# Altium schematic sheet UI.SchDoc
size A4; SheetNumber: 6; SheetTotal: 14
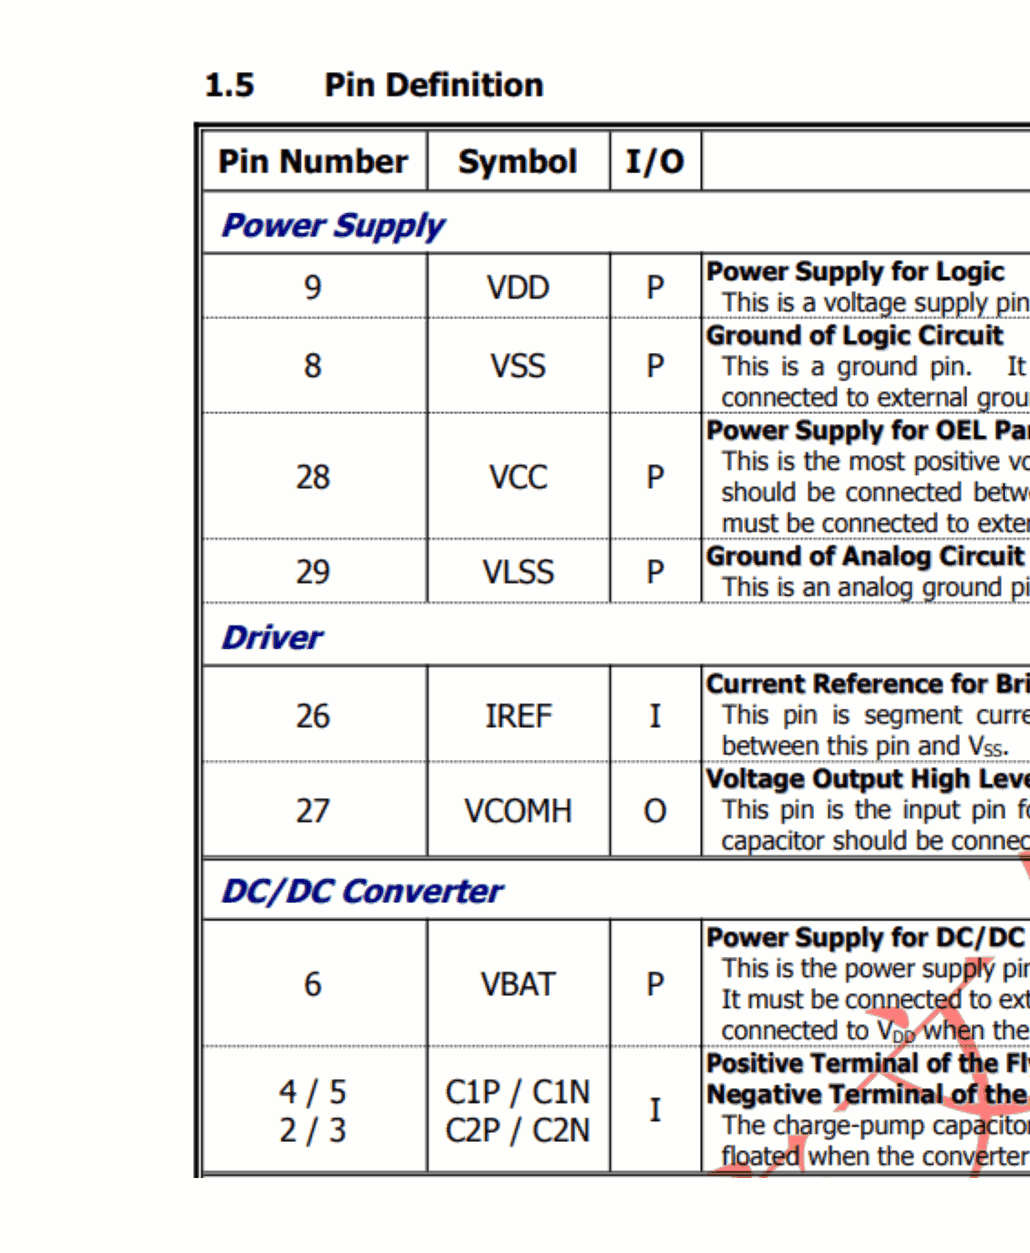
[diagram p0: UI.SchDoc, top left]
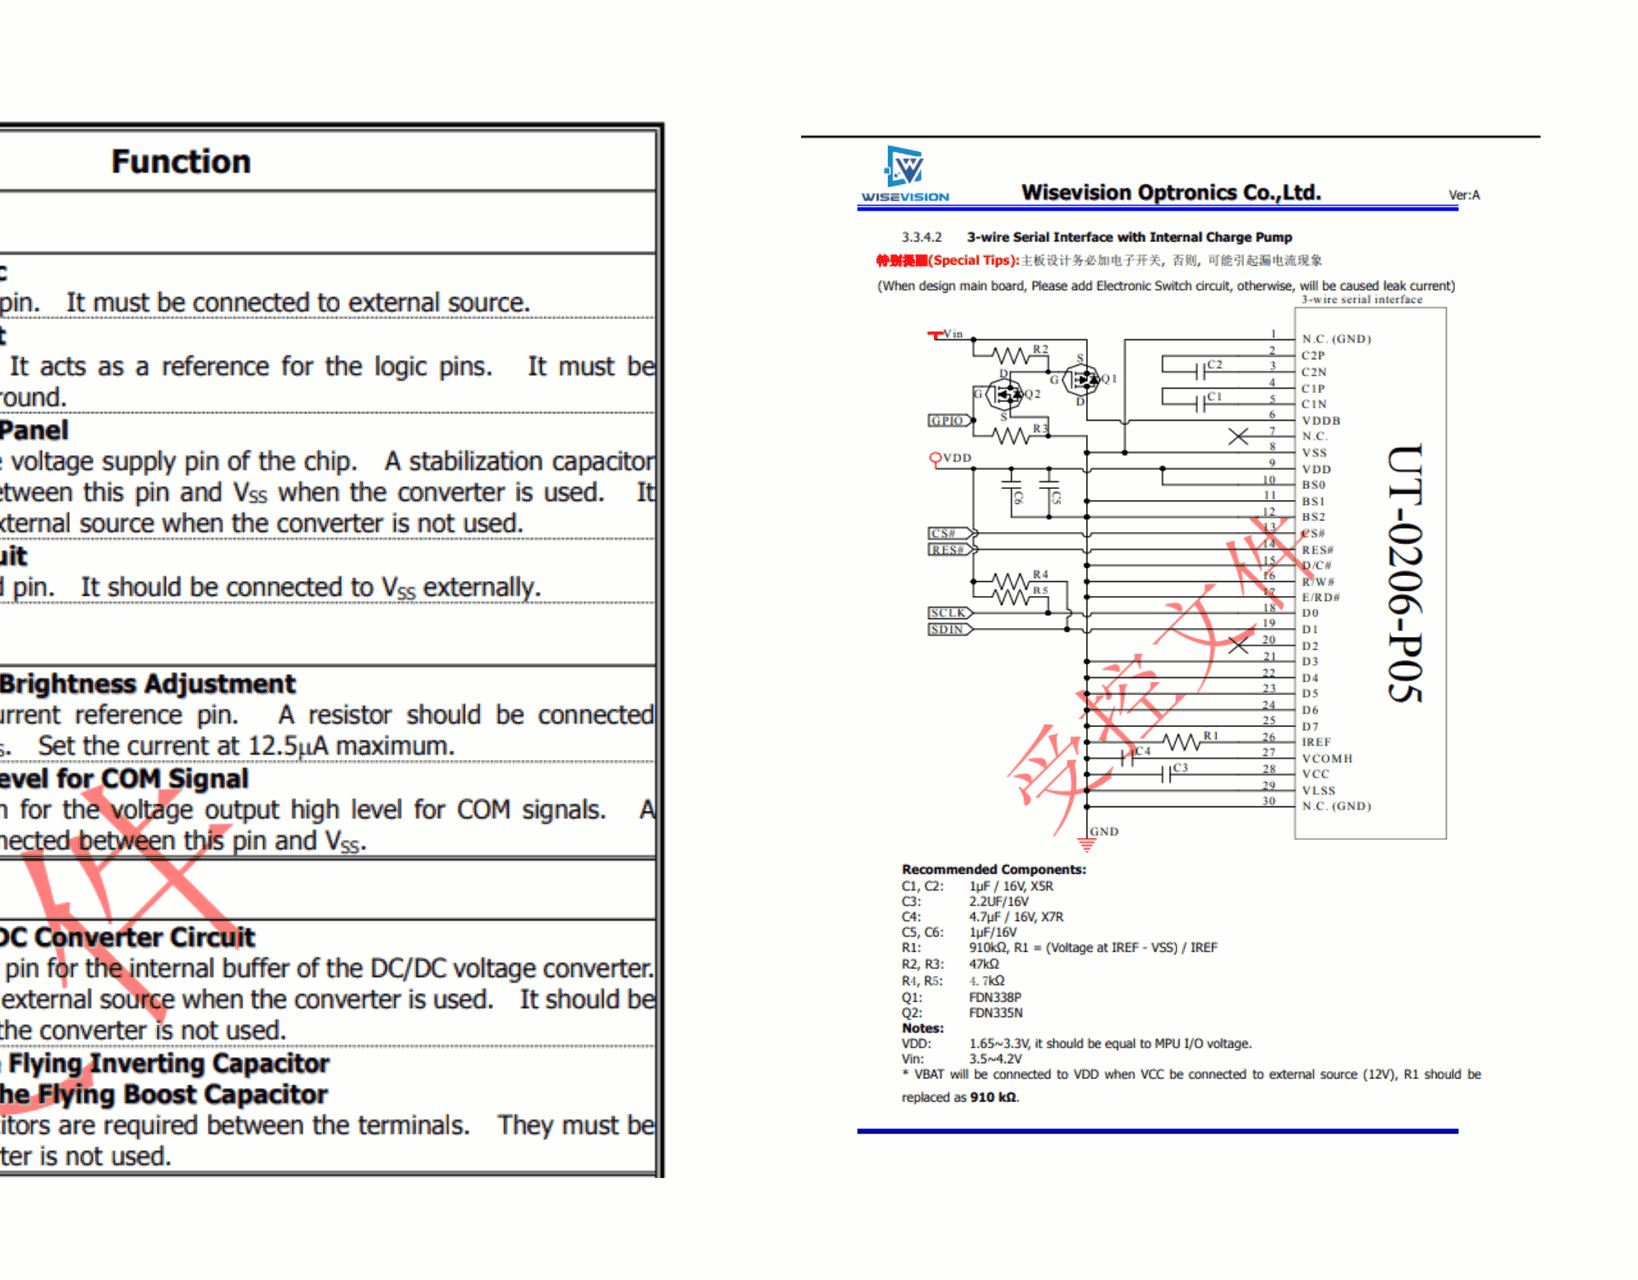
[diagram p1: UI.SchDoc, top right]
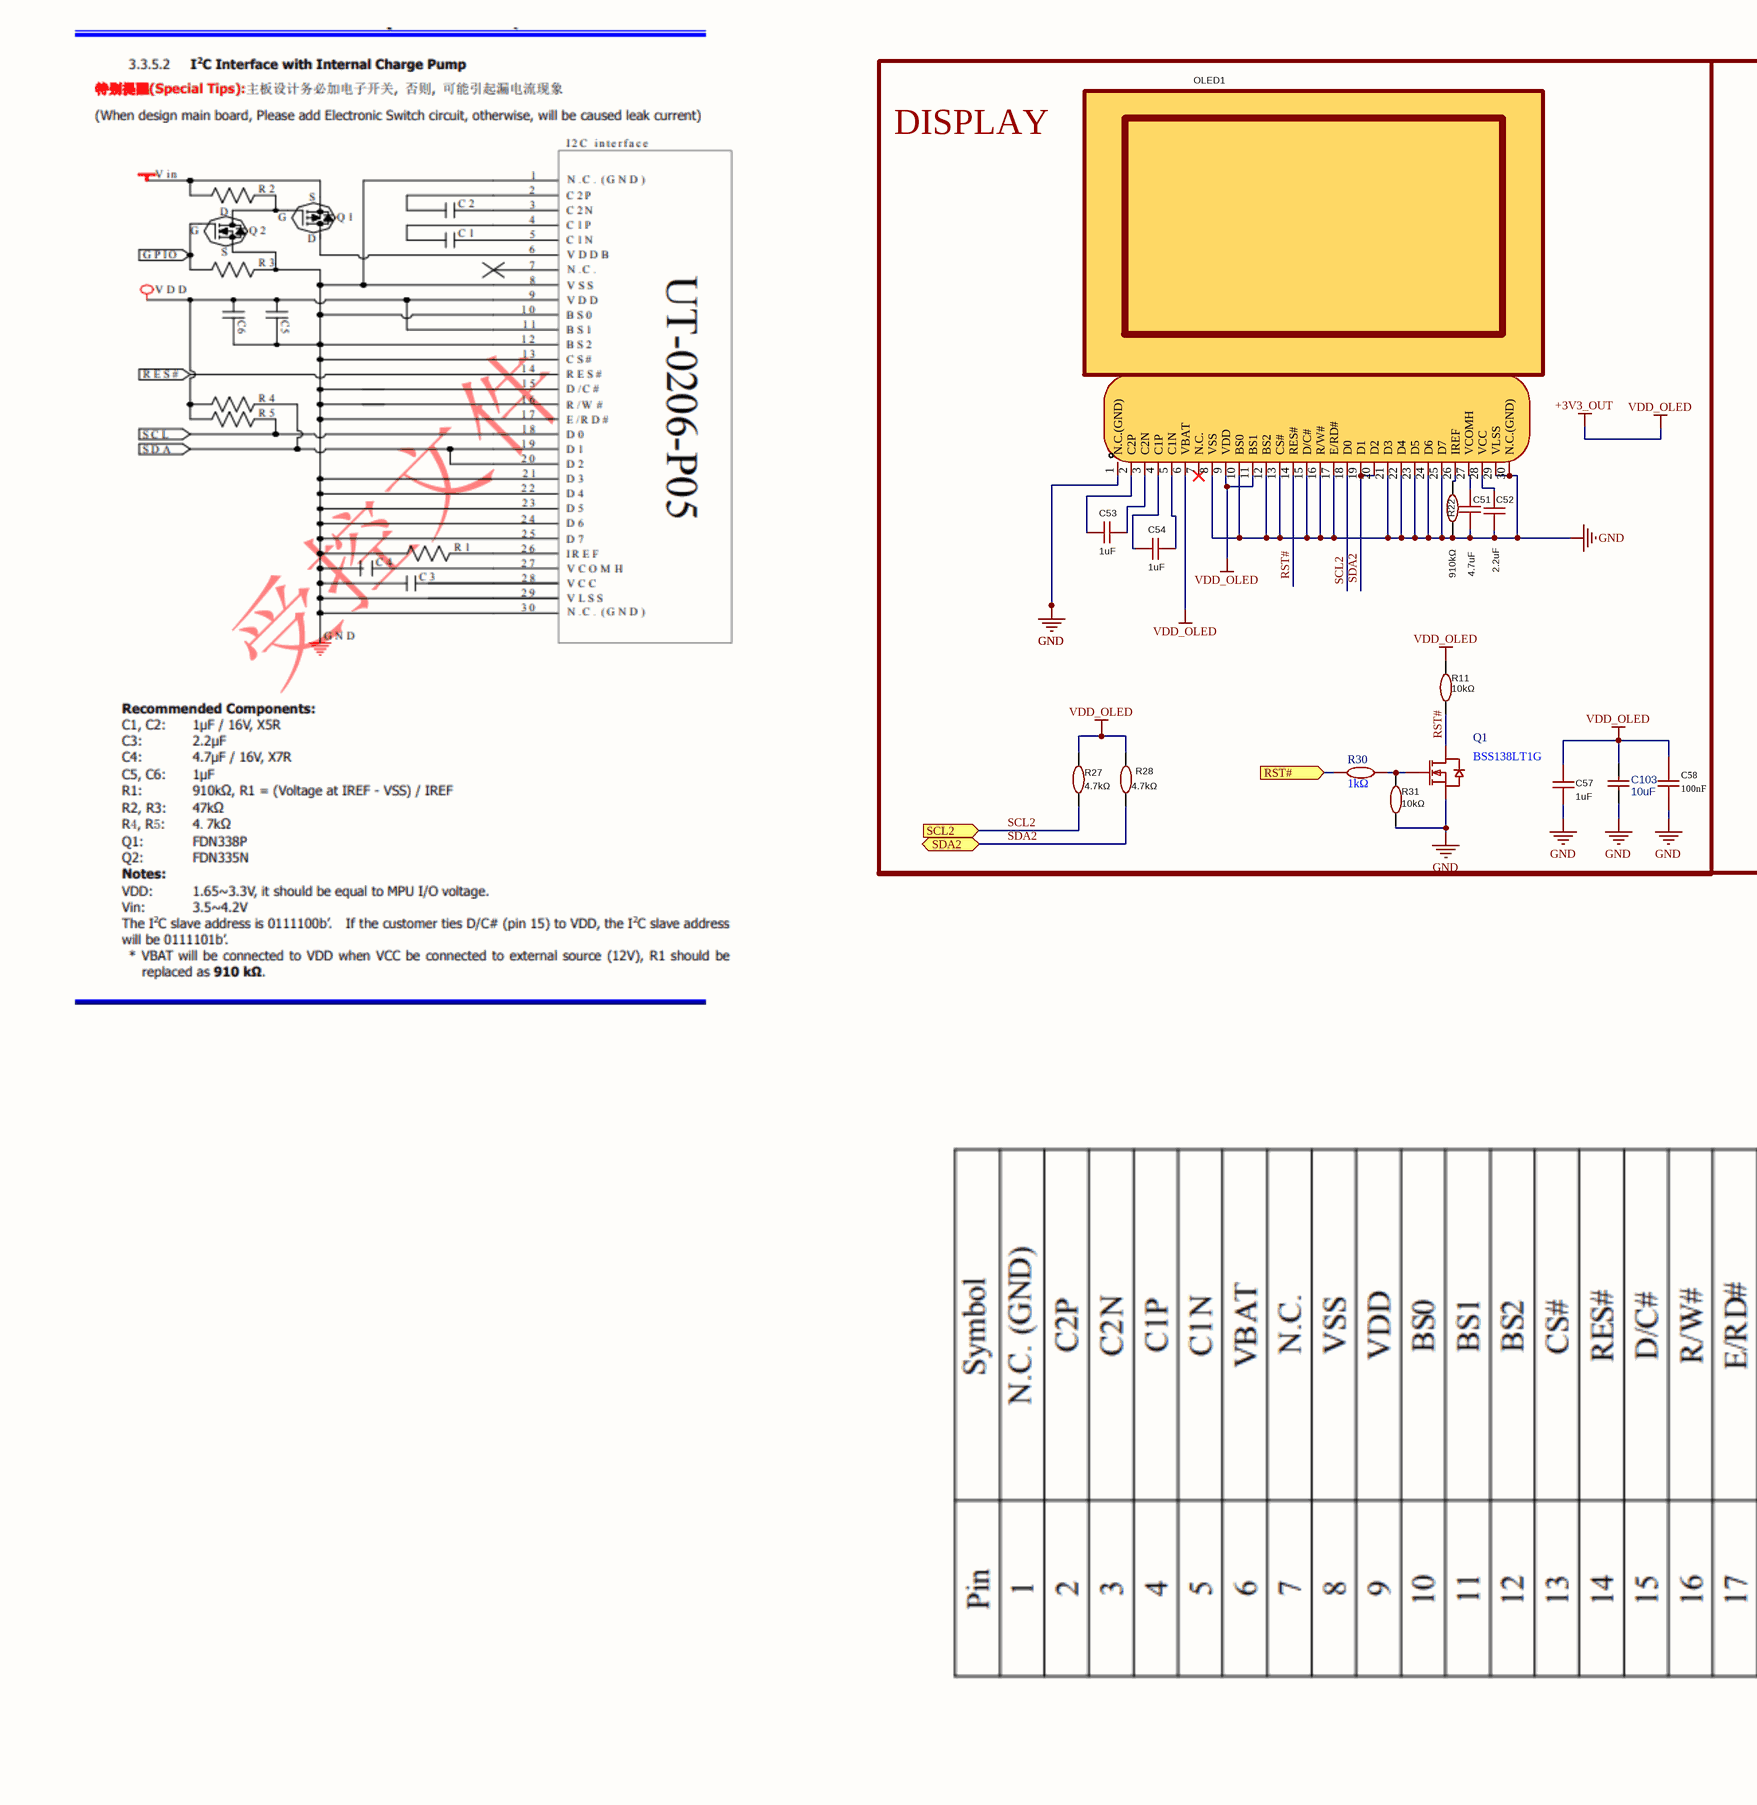
[diagram p2: UI.SchDoc, bottom left]
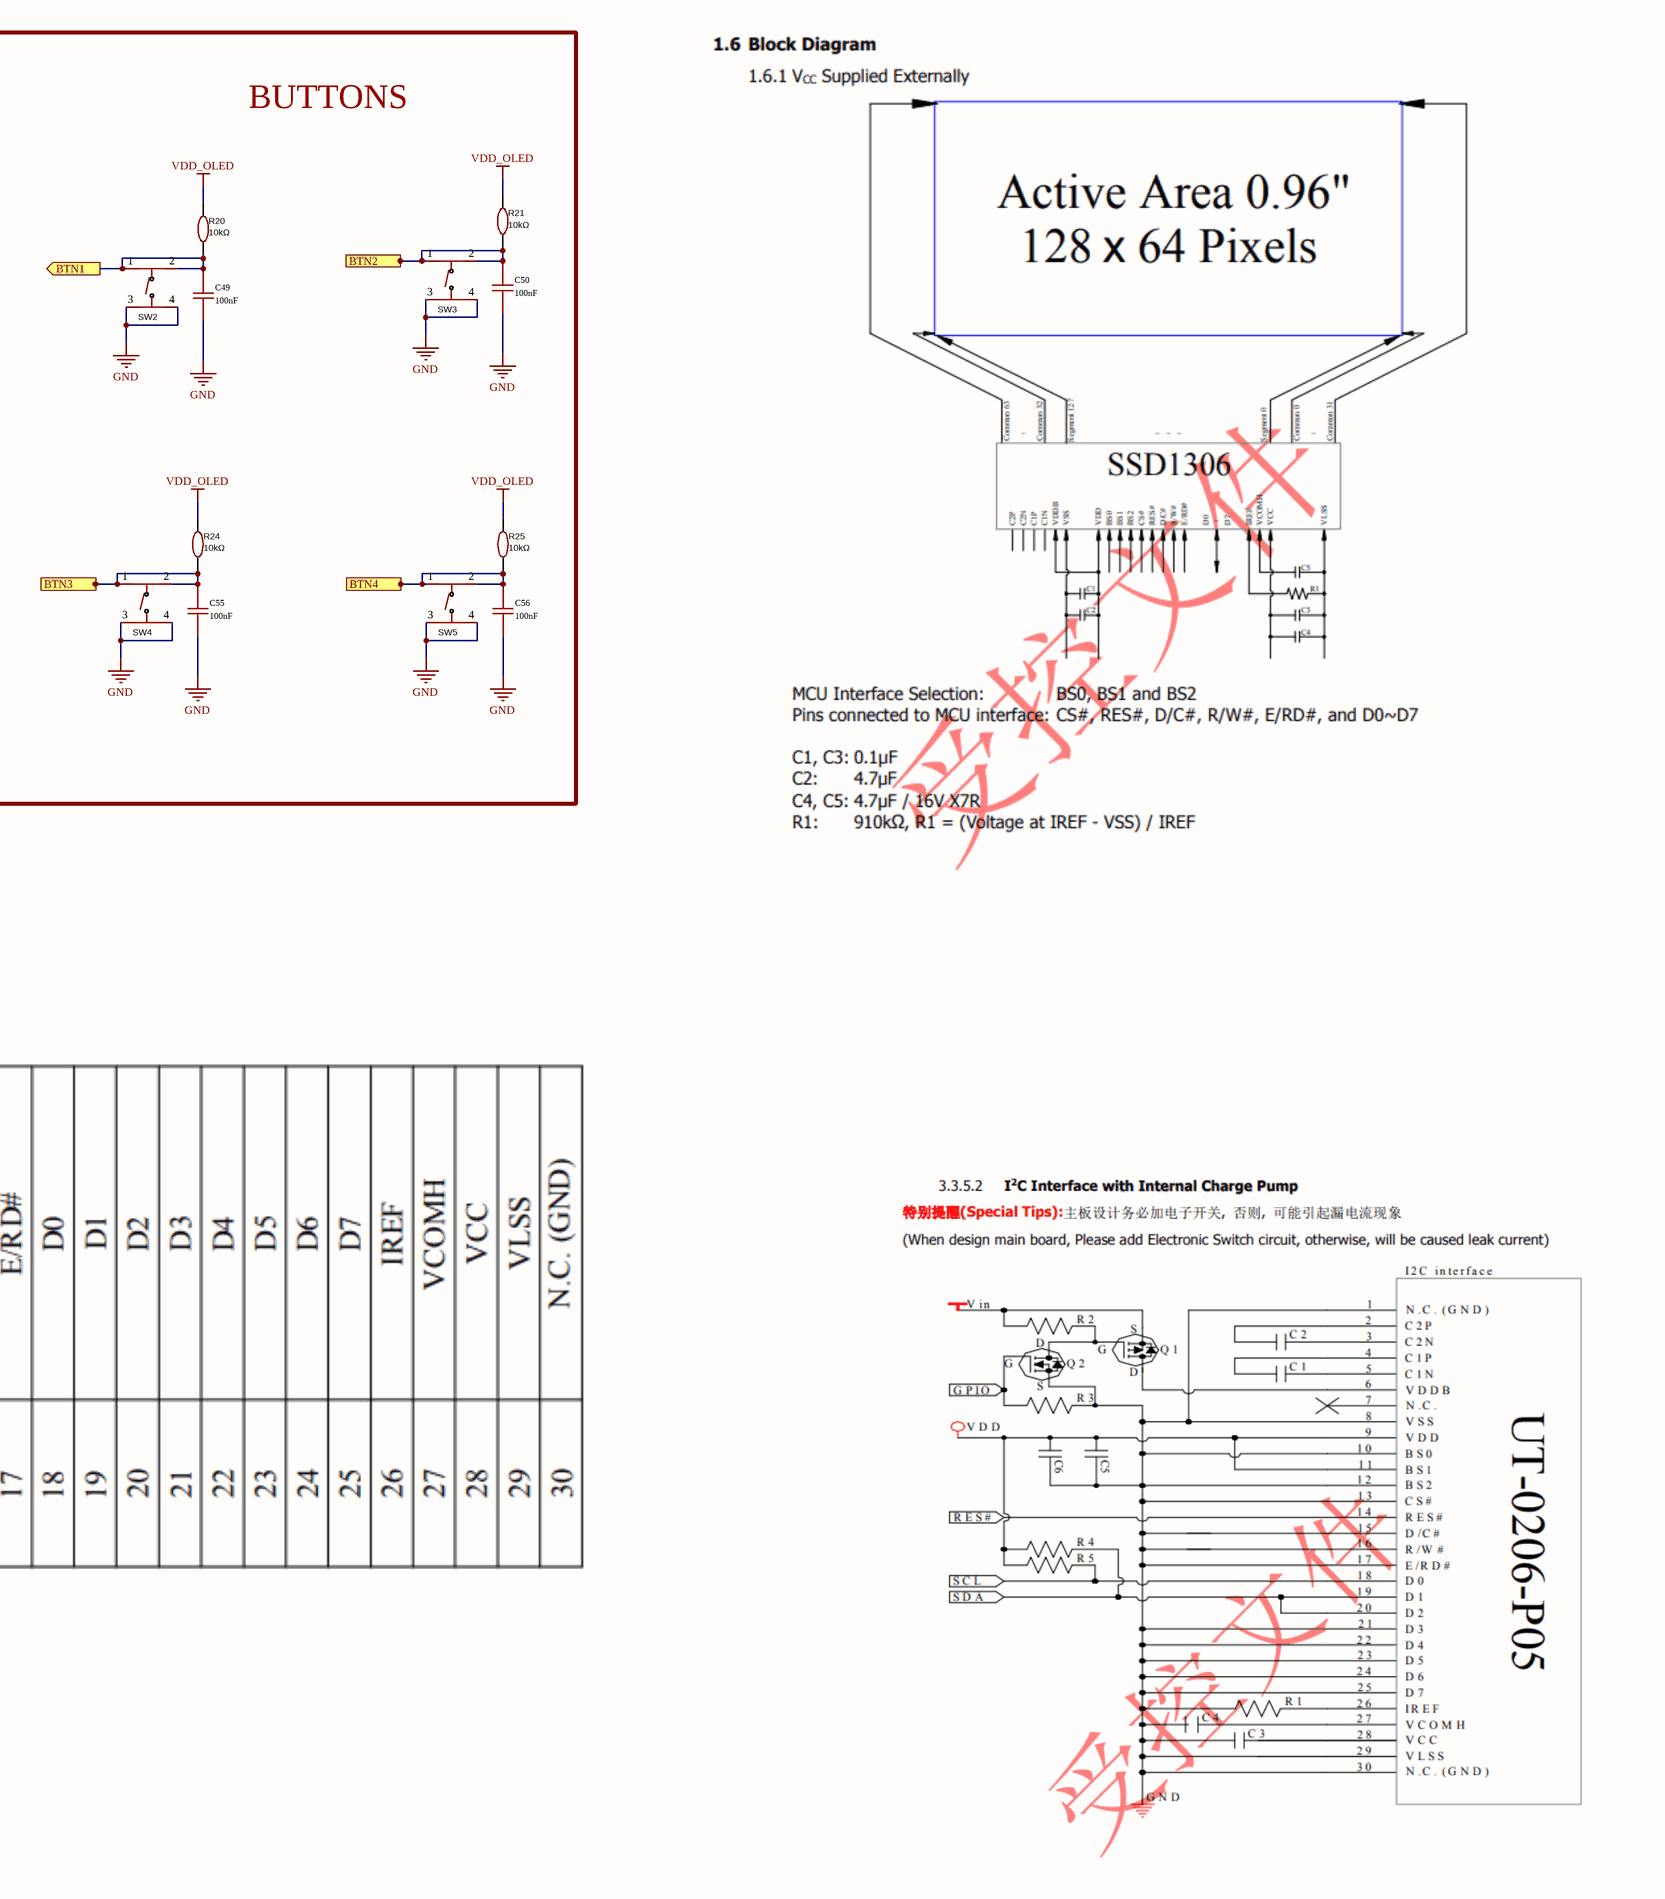
[diagram p3: UI.SchDoc, bottom right]

## Parts
C49  100nF  [C_0603]
C50  100nF  [C_0603]
C51  4.7uF  [C_0805]
C52  2.2uF  [C_0805]
C53  1uF  [C_0805]
C54  1uF  [C_0805]
C55  100nF  [C_0603]
C56  100nF  [C_0603]
C57  1uF  [C_0805]
C58  100nF  [C_0603]
C103  10uF  [C_0805]
OLED1  N096-2864KSWEG01-H30  [OLED-SMD_30P-0.96OLED]  (value not drawn)
Q1  BSS138LT1G  [SOT-23-3_L2.9-W1.6-P1.90-LS2.8-BR]
R11  10kΩ  [R_0603]
R20  10kΩ  [R_0603]
R21  10kΩ  [R_0603]
R22  910kΩ  [R_0603]
R24  10kΩ  [R_0603]
R25  10kΩ  [R_0603]
R27  4.7kΩ  [R_0603]
R28  4.7kΩ  [R_0603]
R30  1kΩ  [R_0603]
R31  10kΩ  [R_0603]
SW2  TS-1187A-B-A-B  [SW-SMD_4P-L5.1-W5.1-P3.70-LS6.5-TL_H1.5]  (value not drawn)
SW3  TS-1187A-B-A-B  [SW-SMD_4P-L5.1-W5.1-P3.70-LS6.5-TL_H1.5]  (value not drawn)
SW4  TS-1187A-B-A-B  [SW-SMD_4P-L5.1-W5.1-P3.70-LS6.5-TL_H1.5]  (value not drawn)
SW5  TS-1187A-B-A-B  [SW-SMD_4P-L5.1-W5.1-P3.70-LS6.5-TL_H1.5]  (value not drawn)

## Blocks framed on the sheet
BUTTONS: C49 C50 C55 C56 R20 R21 R24 R25 SW2-SW5
DISPLAY: C51-C54 C57 C58 C103 OLED1 Q1 R11 R22 R27 R28 R30 R31

## Ports
BTN1 (out), BTN2 (out), BTN3 (out), BTN4 (out), RST# (in), SCL2 (in), SDA2 (bidir)

## Nets
+3V3_OUT: C57.1 C58.2 C103.2 OLED1.6(VBAT) OLED1.9(VDD) OLED1.11(BS1) R11.2 R20.1 R21.1 R24.1 R25.1 R27.2 R28.2  [also labelled VDD_OLED]
GND: C49.1 C50.1 C51.1 C52.1 C55.1 C56.1 C57.2 C58.1 C103.1 OLED1.1(N.C.(GND)) OLED1.8(VSS) OLED1.10(BS0) OLED1.12(BS2) OLED1.13(CS#) OLED1.15(D/C#) OLED1.16(R/W#) OLED1.17(E/RD#) OLED1.21(D3) OLED1.22(D4) OLED1.23(D5) OLED1.24(D6) OLED1.25(D7) OLED1.29(VLSS) OLED1.30(N.C.(GND)) Q1.2(S) R22.1 R31.2 SW2.3(C) SW2.4(D) SW3.3(C) SW3.4(D) SW4.3(C) SW4.4(D) SW5.3(C) SW5.4(D)
BTN1: C49.2 R20.2 SW2.1(A) SW2.2(B) ; port BTN1
BTN2: C50.2 R21.2 SW3.1(A) SW3.2(B) ; port BTN2
BTN3: C55.2 R24.2 SW4.1(A) SW4.2(B) ; port BTN3
BTN4: C56.2 R25.2 SW5.1(A) SW5.2(B) ; port BTN4
RST#: OLED1.14(RES#) Q1.3(D) R11.1
RST#: R30.2 ; port RST#  [a separate net that carries the same name]
SCL2: OLED1.18(D0) R27.1 ; port SCL2
SDA2: OLED1.19(D1) OLED1.20(D2) R28.1 ; port SDA2
NetC51_2: C51.2 OLED1.27(VCOMH)
NetC52_2: C52.2 OLED1.28(VCC)
NetC53_1: C53.1 OLED1.2(C2P)
NetC53_2: C53.2 OLED1.3(C2N)
NetC54_1: C54.1 OLED1.4(C1P)
NetC54_2: C54.2 OLED1.5(C1N)
NetOLED1_26: OLED1.26(IREF) R22.2
NetQ1_1: Q1.1(G) R30.1 R31.1

Not connected (* = marked no-connect by the designer): OLED1 7(N.C.)*

## Notes on the sheet
- Project Name:
- Size:
- Date:
- A4
- Version:
- Time:
- V1.4.0.0
- Sheet:
- Of
- File:

## Library data of the parts
C49 C50 C55 C56 C58 = CC0603KRX7R9BB104: Manufacturer: YAGEO(国巨); Add into BOM: yes; Tolerance: ±10%; Voltage Rating: 50V; Temperature Coefficient: X7R; Symbol: CC0603KRX7R9BB104; Device: CC0603KRX7R9BB104; LCSC Part Name: 100nF ±10% 50V; Supplier Part: C14663; Manufacturer Part: CC0603KRX7R9BB104; Supplier Footprint: 0603; JLCPCB Part Class: Basic Part; Datasheet: https://item.szlcsc.com/datasheet/CC0603KRX7R9BB104/15331.html; Supplier: LCSC; Convert to PCB: yes; Value: 100nF
C51 = CL21A475KBQNNNE: Manufacturer: SAMSUNG(三星); Add into BOM: yes; Tolerance: ±10%; Voltage Rating: 50V; Temperature Coefficient: X5R; Symbol: CL21A475KBQNNNE; Device: CL21A475KBQNNNE; LCSC Part Name: 4.7uF ±10% 50V; Supplier Part: C98192; Manufacturer Part: CL21A475KBQNNNE; Supplier Footprint: 0805; JLCPCB Part Class: Extended Part; Datasheet: https://item.szlcsc.com/datasheet/CL21A475KBQNNNE/99401.html; Supplier: LCSC; Convert to PCB: yes; Value: 4.7uF
C52 = CL21B225KAFNNNE: Manufacturer: SAMSUNG(三星); Add into BOM: yes; Tolerance: ±10%; Voltage Rating: 25V; Temperature Coefficient: X7R; Symbol: CL21B225KAFNNNE; Device: CL21B225KAFNNNE; LCSC Part Name: 2.2uF ±10% 25V; Supplier Part: C19110; Manufacturer Part: CL21B225KAFNNNE; Supplier Footprint: 0805; JLCPCB Part Class: Extended Part; Datasheet: https://item.szlcsc.com/datasheet/CL21B225KAFNNNE/19814.html; Supplier: LCSC; Convert to PCB: yes; Value: 2.2uF
C53 C54 C57 = CL21B105KBFNNNE: Manufacturer: SAMSUNG(三星); Add into BOM: yes; Tolerance: ±10%; Voltage Rating: 50V; Temperature Coefficient: X7R; Symbol: CL21B105KBFNNNE; Device: CL21B105KBFNNNE; Supplier: LCSC; Manufacturer Part: CL21B105KBFNNNE; Value: 1uF; Supplier Part: C28323; JLCPCB Part Class: Basic Part; LCSC Part Name: 1uF ±10% 50V; Supplier Footprint: 0805; Datasheet: https://item.szlcsc.com/datasheet/CL21B105KBFNNNE/29074.html; Convert to PCB: yes
C103 = 10uF: Manufacturer Part: CL21A106KOQNNNE; Manufacturer: SAMSUNG(三星); nameAlias: Value; Supplier: LCSC; Supplier Part: C1713; JLCPCB Part Class: Extended Part; spicePre: C; spiceSymbolName: CL21A106KOQNNNE
OLED1 = N096-2864KSWEG01-H30: Manufacturer: Wisevision(新智景); Add into BOM: yes; Controller Type: SSD1306; Symbol: N096-2864KSWEG01-H30; Device: N096-2864KSWEG01-H30; LCSC Part Name: 0.96寸 白色 128x64像素分辨率 单色 30PIN; Supplier Part: C2890596; Manufacturer Part: N096-2864KSWEG01-H30; Supplier Footprint: -; JLCPCB Part Class: Extended Part; Supplier: LCSC; Convert to PCB: yes; Size: 0.96
Q1 = BSS138LT1G: Manufacturer: onsemi(安森美); Add into BOM: yes; Number: 1 N-Channel; Drain to Source Voltage: 50V; Current - Continuous Drain(Id): 200mA; RDS(on): 5.6Ω@2.75V; Pd - Power Dissipation: 225mW; Gate Threshold Voltage (Vgs(th)): 500mV; Input Capacitance(Ciss): 50pF@25V; Reverse Transfer Capacitance (Crss@Vds): 5pF@25V; Symbol: BSS138LT1G; Device: BSS138LT1G; LCSC Part Name: 1个N沟道 耐压:50V 电流:200mA; Supplier Part: C82045; Manufacturer Part: BSS138LT1G; Supplier Footprint: SOT-23; JLCPCB Part Class: Extended Part; Datasheet: https://item.szlcsc.com/datasheet/BSS138LT1G/83200.html; Supplier: LCSC; Convert to PCB: yes; Operating Temperature: -55℃~+150℃
R11 R20 R21 R24 R25 R31 = 10kΩ: Manufacturer: YAGEO(国巨); Manufacturer Part: RC0603FR-0710KL; nameAlias: Value; Supplier: LCSC; Supplier Part: C98220; JLCPCB Part Class: Extended Part; spicePre: R; spiceSymbolName: RC0603FR-0710KL
R22 = 910kΩ: Manufacturer: YAGEO(国巨); Manufacturer Part: RC0603FR-07910KL; nameAlias: Value; Supplier: LCSC; Supplier Part: C137672; JLCPCB Part Class: Extended Part; spicePre: R; spiceSymbolName: RC0603FR-07910KL
R27 R28 = 4.7kΩ: Manufacturer: YAGEO(国巨); Manufacturer Part: RC0603FR-074K7L; nameAlias: Value; Supplier: LCSC; Supplier Part: C99782; JLCPCB Part Class: Extended Part; spicePre: R; spiceSymbolName: RC0603FR-074K7L
R30 = RC0603FR-071KL: Manufacturer: YAGEO(国巨); Add into BOM: yes; Tolerance: ±1%; Power(Watts): 100mW; Voltage-Supply(Max): 75V; Temperature Coefficient: ±100ppm/℃; Symbol: RC0603FR-071KL; Device: RC0603FR-071KL; LCSC Part Name: 厚膜电阻 1kΩ ±1% 100mW; Supplier Part: C22548; Manufacturer Part: RC0603FR-071KL; Supplier Footprint: 0603; JLCPCB Part Class: Extended Part; Datasheet: https://atta.szlcsc.com/upload/public/pdf/source/20180316/70C0E2BDAE7FCC62C531A5A58D202EE1.pdf; Supplier: LCSC; Convert to PCB: yes; Type: Thick Film Resistors; Value: 1kΩ; Operating Temperature: -55℃~+155℃
SW2-SW5 = TS-1187A-B-A-B: Manufacturer: XKB Connection(中国星坤); Add into BOM: yes; Circuit: SPST; Actuator Style: Round Button; Operating Force: 1.6N; Switch Height: 1.5mm; with Bracket: Without Bracket; Contact Current: 50mA; Voltage Rating: 12V; Actuator/Cap Color: Gold; With Lamp: No; Life: 100,000 Cycles; Symbol: TS-1187A-B-A-B; Device: TS-1187A-B-A-B; LCSC Part Name: 5.1*5.1*1.5mm 立贴 轻触开关; Supplier Part: C318884; Manufacturer Part: TS-1187A-B-A-B; Supplier Footprint: SMD; JLCPCB Part Class: Basic Part; Datasheet: https://item.szlcsc.com/datasheet/TS-1187A-B-A-B/299976.html; Supplier: LCSC; Convert to PCB: yes; Mounting Type: Surface Mount,Vertical; Length: 5.1mm; Width: 5.1mm; Operating Temperature: -30℃~+85℃